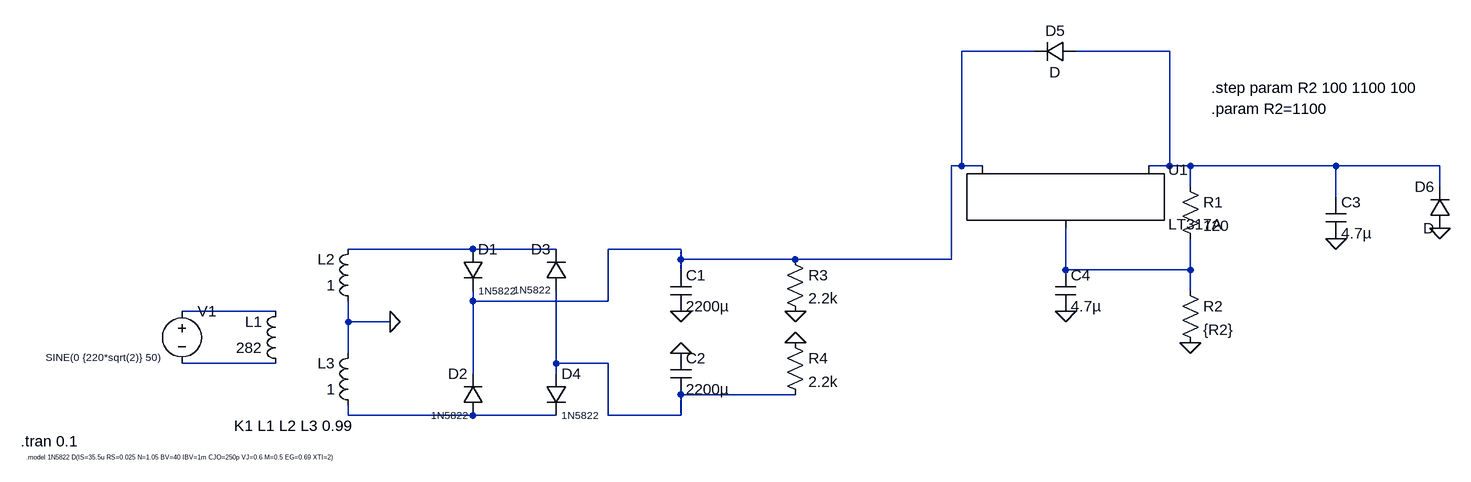
[diagram p0: schematic schematic.asc]
schematic.asc, the LTspice schematic file:
Version 4.1
SHEET 1 1908 680
WIRE 1264 -256 1152 -256
WIRE 1472 -256 1328 -256
WIRE 1152 -80 1152 -256
WIRE 1152 -80 1136 -80
WIRE 1184 -80 1152 -80
WIRE 1472 -80 1472 -256
WIRE 1472 -80 1440 -80
WIRE 1504 -80 1472 -80
WIRE 1728 -80 1504 -80
WIRE 1888 -80 1728 -80
WIRE 1504 -48 1504 -80
WIRE 1888 -48 1888 -80
WIRE 1728 -32 1728 -80
WIRE 400 48 208 48
WIRE 528 48 400 48
WIRE 720 48 608 48
WIRE 720 64 720 48
WIRE 896 64 720 64
WIRE 1136 64 1136 -80
WIRE 1136 64 896 64
WIRE 720 80 720 64
WIRE 1312 80 1312 16
WIRE 1504 80 1504 32
WIRE 1504 80 1312 80
WIRE 1504 112 1504 80
WIRE 400 128 400 112
WIRE 608 128 608 48
WIRE 608 128 400 128
WIRE 96 144 -48 144
WIRE 208 160 208 128
WIRE 272 160 208 160
WIRE 208 208 208 160
WIRE 96 224 -48 224
WIRE 528 224 528 112
WIRE 608 224 528 224
WIRE 400 240 400 128
WIRE 528 240 528 224
WIRE 896 272 720 272
WIRE 208 304 208 288
WIRE 400 304 208 304
WIRE 528 304 400 304
WIRE 608 304 608 224
WIRE 720 304 720 272
WIRE 720 304 608 304
FLAG 272 160 0
FLAG 720 144 0
FLAG 720 208 0
FLAG 1504 192 0
FLAG 1728 32 0
FLAG 1312 144 0
FLAG 1888 16 0
FLAG 896 144 0
FLAG 896 192 0
SYMBOL voltage -48 128 R0
WINDOW 3 -122 97 Bottom 1
WINDOW 123 0 0 Left 0
WINDOW 39 0 0 Left 0
SYMATTR Value SINE(0 {220*sqrt(2)} 50)
SYMATTR InstName V1
SYMBOL ind 112 240 R180
WINDOW 0 36 80 Left 2
WINDOW 3 36 40 Left 2
SYMATTR InstName L1
SYMATTR Value 282
SYMATTR Type ind
SYMATTR SpiceLine Rser=0.1
SYMBOL ind 224 144 R180
WINDOW 0 36 80 Left 2
WINDOW 3 36 40 Left 2
SYMATTR InstName L2
SYMATTR Value 1
SYMATTR Type ind
SYMATTR SpiceLine Rser=0.1
SYMBOL ind 224 304 R180
WINDOW 0 36 80 Left 2
WINDOW 3 36 40 Left 2
SYMATTR InstName L3
SYMATTR Value 1
SYMATTR Type ind
SYMATTR SpiceLine Rser=0.1
SYMBOL diode 384 48 R0
WINDOW 3 81 64 Right 1
SYMATTR Value 1N5822
SYMATTR InstName D1
SYMBOL diode 416 304 R180
WINDOW 0 24 64 Left 2
WINDOW 3 24 0 Left 1
SYMATTR InstName D2
SYMATTR Value 1N5822
SYMBOL diode 544 112 R180
WINDOW 0 24 64 Left 2
WINDOW 3 53 -9 Top 1
SYMATTR InstName D3
SYMATTR Value 1N5822
SYMBOL diode 512 240 R0
WINDOW 3 24 64 Left 1
SYMATTR Value 1N5822
SYMATTR InstName D4
SYMBOL cap 704 80 R0
SYMATTR InstName C1
SYMATTR Value 2200µ
SYMBOL cap 704 208 R0
SYMATTR InstName C2
SYMATTR Value 2200µ
SYMBOL PowerProducts\\LT317A 1312 -80 R0
SYMATTR InstName U1
SYMBOL res 1488 -64 R0
SYMATTR InstName R1
SYMATTR Value 120
SYMBOL res 1488 96 R0
SYMATTR InstName R2
SYMATTR Value {R2}
SYMBOL diode 1328 -272 R90
WINDOW 0 0 32 VBottom 2
WINDOW 3 32 32 VTop 2
SYMATTR InstName D5
SYMBOL cap 1712 -32 R0
SYMATTR InstName C3
SYMATTR Value 4.7µ
SYMBOL cap 1296 80 R0
SYMATTR InstName C4
SYMATTR Value 4.7µ
SYMBOL diode 1904 16 R180
WINDOW 0 24 64 Left 2
WINDOW 3 24 0 Left 2
SYMATTR InstName D6
SYMBOL res 880 48 R0
SYMATTR InstName R3
SYMATTR Value 2.2k
SYMBOL res 880 176 R0
SYMATTR InstName R4
SYMATTR Value 2.2k
TEXT -296 344 Left 2 !.tran 0.1
TEXT 32 320 Left 2 !K1 L1 L2 L3 0.99
TEXT -288 368 Left 0 !.model 1N5822 D(IS=35.5u RS=0.025 N=1.05 BV=40 IBV=1m CJO=250p VJ=0.6 M=0.5 EG=0.69 XTI=2)
TEXT 1536 -168 Left 2 !.param R2=1100
TEXT 1536 -200 Left 2 !.step param R2 100 1100 100

The netlist it stands for:
* schematic.asc
V1 N005 N006 SINE(0 {220*sqrt(2)} 50)
L1 N006 N005 282 Rser=0.1
L2 0 N003 1 Rser=0.1
L3 N008 0 1 Rser=0.1
D1 N003 N001 1N5822
D2 N008 N001 1N5822
D3 N007 N003 1N5822
D4 N007 N008 1N5822
C1 N001 0 2200µ
C2 0 N007 2200µ
X§U1 N004 N002 N001 LT317A
R1 N002 N004 120
R2 N004 0 {R2}
D5 N002 N001 D
C3 N002 0 4.7µ
C4 N004 0 4.7µ
D6 0 N002 D
R3 N001 0 2.2k
R4 0 N007 2.2k
.model D D
.lib standard.dio
.tran 0.1
K1 L1 L2 L3 0.99
.model 1N5822 D(IS=35.5u RS=0.025 N=1.05 BV=40 IBV=1m CJO=250p VJ=0.6 M=0.5 EG=0.69 XTI=2)
.param R2=1100
.step param R2 100 1100 100
.lib LTC.lib
.backanno
.end